# EAGLE design ATTINY85-V3.1 (EAGLE 6.1)
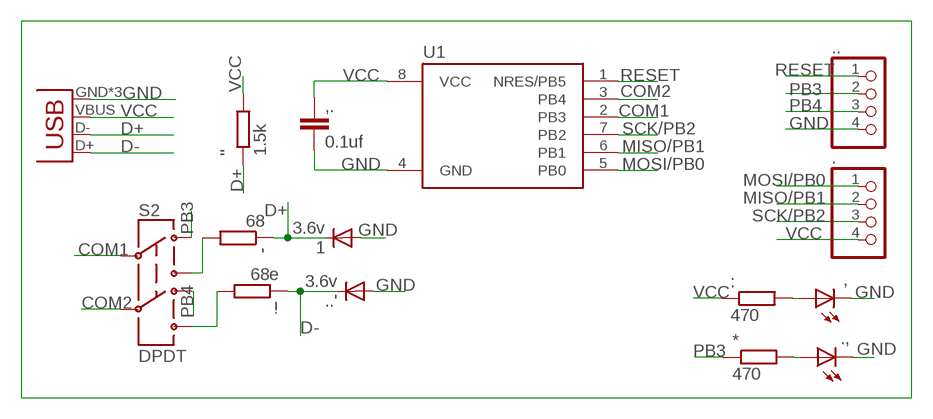
[diagram p0: schematic, sheet 1]

## Parts
1  3.6v  DIODE-MINIMELF  [MINIMELF]
!  68e  R-EU_M0805  [M0805]
'  68  R-EU_M0805  [M0805]
''  1.5k  R-EU_M0805  [M0805]
*  470  R-EU_M0805  [M0805]
+  USB-MICROB  [USB-MICROB]
,  LEDSML0805  [SML0805]
,.  0.1uf  C-EUC0805K  [C0805K]
.  HEADER-1X4ROUND  [1X04_ROUND]
.,  LEDSML0805  [SML0805]
..  HEADER-1X4ROUND  [1X04_ROUND]
..'  3.6v  DIODE-MINIMELF  [MINIMELF]
:  470  R-EU_M0805  [M0805]
S2  DPDT  SWITCH-DPDTAYZ0202  [AYZ0202]
U1  ATTINY85-20S  [SOIC8_EIAJ_208MIL]

## Nets
COM1: S2.2 U1.2(PB3)
COM2: S2.5 U1.3(PB4)
D+: 1.C ''.1 '.1 +.D-
D-: !.1 +.D+ ..'.C
GND: 1.A +.GND +.MT1(GND) +.MT2(GND) ,..2 ,.C .,.C ..'.A ...4 U1.4(GND)
MISO/PB1: ..2 U1.6(PB1)
MOSI/PB0: ..1 U1.5(PB0)
N$2: ,.A :.2
N$3: '.2 S2.3
N$4: !.2 S2.6
N$5: *.2 .,.A
PB3: *.1 ...2 S2.1
PB4: ...3 S2.4
RESET: ...1 U1.1(NRES/PB5)
SCK/PB2: ..3 U1.7(PB2)
VCC: ''.2 +.VBUS ,..1 ..4 :.1 U1.8(VCC)

## Library data of the parts
1 ..' = diode:DIODE-: DIODE
! ' '' * : = rcl:R-EU_: RESISTOR, European symbol
+ = SparkFun-Connectors:USB: USB Connectors USB-B-PTH is fully proven SKU : PRT-00139/CONN-08278 USB-miniB is fully proven SKU : PRT-00587 USB-A-PCB is untested. USB-A-H is throughly reviewed, but untested. Spark Fun Electronics SKU : PRT-00437 USB-B-SMT is throughly reviewed, but untested. Needs silkscreen touching up. USB-A-S has not been used/tested USB-MB-H has not been used/tested USB-MICROB has been used. CONN-09505; PROD_ID: CONN-09505
, ., = led:LED: LED OSRAM: - CHIPLED LG R971, LG N971, LY N971, LG Q971, LY Q971, LO R971, LY R971 LH N974, LH R974 LS Q976, LO Q976, LY Q976 LO Q996 - Hyper CHIPLED LW Q18S LB Q993, LB Q99A, LB R99A - SideLED LS A670, LO A670, LY A670, LG A670, LP A670 LB A673, LV A673, LT A673, LW A673 LH A674 LY A675 LS A676, LA A676, LO A676, LY A676, LW A676 LS A679, LY A679, LG A679 - Hyper Micro SIDELED® LS Y876, LA Y876, LO Y876, LY Y876 LT Y87S - SmartLED LW L88C, LW L88S LB L89C, LB L89S, LG L890 LS L89K, LO L89K, LY L89K LS L896, LA L896, LO L896, LY L896 - TOPLED LS T670, LO T670, LY T670, LG T670, LP T670 LSG T670, LSP T670, LSY T670, LOP T670, LYG T670 LG T671, LOG T671, LSG T671 LB T673, LV T673, LT T673, LW T673 LH T674 LS T676, LA T676, LO T676, LY T676, LB T676, LH T676, LSB T676, LW T676 LB T67C, LV T67C, LT T67C, LS T67K, LO T67K, LY T67K, LW E67C LS E67B, LA E67B, LO E67B, LY E67B, LB E67C, LV E67C, LT E67C LW T67C LS T679, LY T679, LG T679 LS T770, LO T770, LY T770, LG T770, LP T770 LB T773, LV T773, LT T773, LW T773 LH T774 LS E675, LA E675, LY E675, LS T675 LS T776, LA T776, LO T776, LY T776, LB T776 LHGB T686 LT T68C, LB T68C - Hyper Mini TOPLED® LB M676 - Mini TOPLED Santana® LG M470 LS M47K, LO M47K, LY M47K Source: http://www.osram.convergy.de LUXEON: - LUMILED® LXK2-PW12-R00, LXK2-PW12-S00, LXK2-PW14-U00, LXK2-PW14-V00 LXK2-PM12-R00, LXK2-PM12-S00, LXK2-PM14-U00 LXK2-PE12-Q00, LXK2-PE12-R00, LXK2-PE12-S00, LXK2-PE14-T00, LXK2-PE14-U00 LXK2-PB12-K00, LXK2-PB12-L00, LXK2-PB12-M00, LXK2-PB14-N00, LXK2-PB14-P00, LXK2-PB14-Q00 LXK2-PR12-L00, LXK2-PR12-M00, LXK2-PR14-Q00, LXK2-PR14-R00 LXK2-PD12-Q00, LXK2-PD12-R00, LXK2-PD12-S00 LXK2-PH12-R00, LXK2-PH12-S00 LXK2-PL12-P00, LXK2-PL12-Q00, LXK2-PL12-R00 Source: www.luxeon.com KINGBRIGHT: KA-3528ASYC Source: www.kingbright.com
,. = rcl:C-EU: CAPACITOR, European symbol
. .. = microbuilder:HEADER-1X4: PIN HEADER
S2 = SparkFun-Electromechanical:SWITCH-DPDT: DPDT Version of the COM-00597; PROD_ID: SWCH-08179
U1 = _hhn_attiny25_45_85:ATTINY85*: ATMEL ATtiny 85 Packages: P = PDIP 08 30mil S = SOIC 08 EIAJ 208mil Technologies Note: for complete ordering code (temp. range, finish, tape&reel etc.) see www.atmel.com • Supply Voltage: V = (1.8…5.5)V | [blank] = (2.7…5.5)V • Speed: 10 = 10 MHz | 20 = 20 MHz Author: Dipl.-Ing. FH Rainer Bayer HHN Hochschule Heilbronn (Heilbronn University), rainer.bayer@hs-heilbronn.de Ingenieurbüro ing-rb, mail@ing-rb.de

## Net classes
0 default: width 0.254 mm, clearance 0.152 mm
1 Power: width 0.254 mm, clearance 0.152 mm

## Board
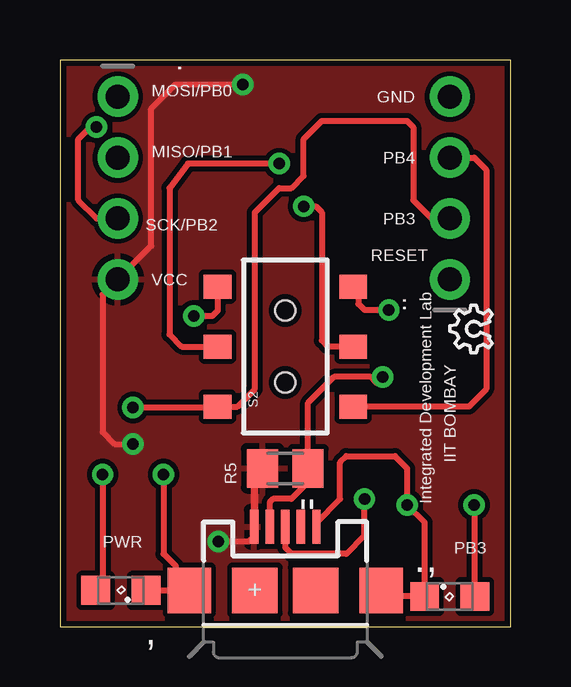
[diagram p1: board, top side]
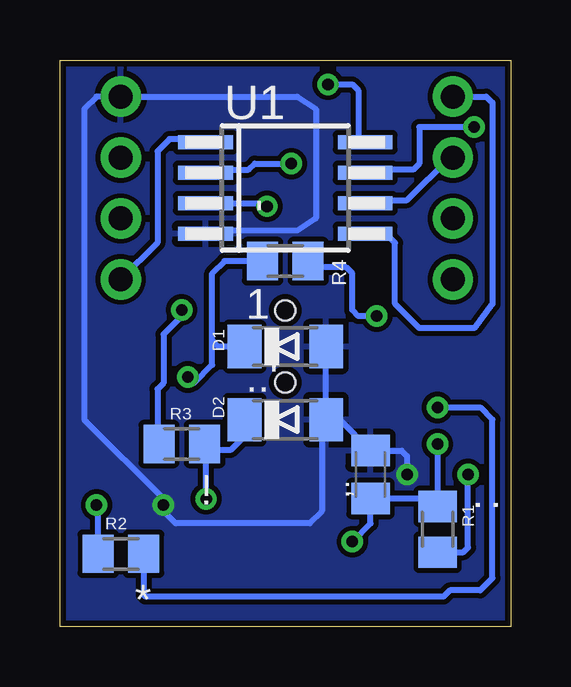
[diagram p2: board, bottom side, seen from below]

Size 18.8 x 23.62 mm. Coordinates in mm from the lower left corner, seen from the top.
Outline: 0,0 18.8,0 18.8,23.62 0,23.62 0,0
Copper layers (1*16): Top 0.035mm / dielectric 1.5mm / Bottom 0.035mm
Design rules: minimum track width 10mil, minimum drill 19mil, track to track 8mil, track to pad 8mil, pad to pad 8mil, via to via 8mil, smd to smd 8mil, copper to edge 10mil, drill to drill 8mil, minimum pad ring 10mil, minimum via ring 8mil, stop-mask expansion 4mil, vias tented up to drill 0mil, thermal gap 10mil

### Footprints (pad centres in the part's own frame; a part is rotated, then mirrored left to right if it is on the bottom)
MINIMELF = smd 1.4 x 1.8: A 1.7,0; C -1.7,0
M0805 = smd 1.3 x 1.6: 1 -0.95,0; 2 0.95,0
USB-MICROB = smd 0.35 x 1.4: D+ 0,2.65; D- -0.65,2.65; GND 1.3,2.65; ID 0.65,2.65; VBUS -1.3,2.65 | smd 1.8 x 1.9: MT1 -4,0; MT2 4,0 | smd 1.9 x 1.9: P$1 -1.27,0; P$2 1.27,0
SML0805 = smd 1.2 x 1.2: A 1.05,0; C -1.05,0
C0805K = smd 1.3 x 1.6: 1 -1,0; 2 1,0
1X04_ROUND = drill 1 pad 1.676: 1 -3.81,0; 2 -1.27,0; 3 1.27,0; 4 3.81,0
AYZ0202 = smd 1 x 1.15: 1 -2.5,2.825; 2 0,2.825; 3 2.5,2.825; 4 -2.5,-2.825; 5 0,-2.825; 6 2.5,-2.825 | hole 0.85: 1.5,0; -1.5,0
SOIC8_EIAJ_208MIL = smd 0.6 x 2.286: 1 -1.905,-3.33; 2 -0.635,-3.33; 3 0.635,-3.33; 4 1.905,-3.33; 5 1.905,3.33; 6 0.635,3.33; 7 -0.635,3.33; 8 -1.905,3.33

### Placement (x,y rotation side)
1  9.4,11.68 0 bottom
!  13.72,7.62 180 bottom
'  9.4,15.24 0 bottom
''  9.4,6.6 180 top
*  16.26,3.05 180 bottom
+  9.4,1.52 0 top
,  2.54,1.52 180 top
,.  5.84,6.35 90 bottom
.  2.41,18.29 270 top
.,  16.26,1.27 0 top
..  16.26,18.29 90 top
..'  9.4,8.64 0 bottom
:  3.05,4.06 270 bottom
S2  9.4,11.68 90 top
U1  9.4,18.29 270 bottom
U$1  [OSHW_6X70_NOTEXT]  18.03,11.43 90 top

### Tracks (layer width: path | path; a pad name or v marks a point on that pad's centre or on a via)
COM1  (via drill 0.48)
  Top 0.254: v9.14,19.3 5.33,19.3 4.57,18.29 4.57,12.19 5.08,11.68 S2.2 6.6,11.68
  Bottom 0.254: U1.2 12.6,19.05 10.92,19.05 10.67,19.3 v9.14,19.3
COM2  (via drill 0.48)
  Top 0.254: S2.5 11.18,11.68 10.92,11.94 10.92,17.27 10.67,17.53 v10.16,17.53
  Bottom 0.254: U1.3 10.29,17.65 v10.16,17.53
D+  (via drill 0.48)
  Top 0.254: v13.46,10.41 13.21,10.16 12.95,10.41 11.43,10.41 10.35,9.33 ''.1 10.16,6.42 10.16,5.84 9.65,5.33 8.89,5.33 8.75,5.19 +.D-
  Bottom 0.254: '.1 11.94,15.24 12.45,14.73 12.45,11.94 | 12.45,11.94 12.45,10.92 13.21,10.16 v13.46,10.41 | 1.C 12.19,11.68 12.45,11.94
D-  (via drill 0.48)
  Top 0.254: v12.7,5.33 12.7,3.81 11.94,3.05 9.65,3.05 9.4,3.3 +.D+
  Bottom 0.254: ..'.C 11.1,7.95 11.68,7.37 12.7,7.37 | 12.7,7.37 12.7,7.62 !.1 | v12.7,5.33 12.7,7.37
GND  (via drill 0.48)
  Top 0.254: ,.C 4.83,1.52 | 4.83,1.52 +.MT1 | +.MT2 13.65,1.27 .,.C 15.21,4.35 v14.48,5.08 14.48,6.6 13.97,7.11 11.94,7.11 11.68,6.86 11.68,5.33 10.67,4.32 10.67,4.2 +.GND | v4.32,6.35 4.32,3.05 4.83,2.54 4.83,1.52
  Bottom 0.254: v4.32,6.35 4.32,7.11 4.56,7.35 ,..2 7.13,8.64 7.62,8.64 | 1.A ..'.A 7.87,8.46 7.87,4.83 8.38,4.32 13.97,4.32 14.48,4.83 v14.48,5.08 14.48,5.33 17.78,8.64 17.78,21.59 17.27,22.1 ...4 8.89,22.1 8.13,21.59 8.13,17.02 8.89,16.51 11.94,16.51 12.06,16.38 U1.4
  pour Bottom: 0,23.62 18.8,23.62 18.8,0 0,0
MISO/PB1
  Bottom 0.254: U1.6 5.94,17.78 4.32,17.78 2.54,19.56 ..2
MOSI/PB0
  Bottom 0.254: ..1 1.02,22.1 0.76,21.84 0.76,13.46 1.52,12.45 3.81,12.45 4.83,13.46 4.83,16 5.21,16.38 U1.5 6.1,16.36 6.1,16.26 6.35,16.26
N$2  (via drill 0.48)
  Top 0.254: v1.78,6.35 1.78,1.81 ,.A
  Bottom 0.254: :.2 1.97,3.11 1.78,3.3 v1.78,6.35
N$3  (via drill 0.48)
  Top 0.254: S2.3 6.57,13.18 6.35,12.95 v5.59,12.95
  Bottom 0.254: v5.59,12.95 6.35,12.95 6.6,13.21 6.6,14.73 6.86,14.99 8.19,14.99 '.2 8.38,15.24 8.38,14.99
N$4  (via drill 0.48)
  Top 0.254: S2.6 12.23,14.44 12.49,14.44 12.45,14.22 12.45,13.46 12.7,13.21 v13.72,13.21
  Bottom 0.254: !.2 14.73,7.69 14.73,9.91 14.48,10.16 14.48,12.19 13.72,12.95 v13.72,13.21
N$5  (via drill 0.48)
  Top 0.254: v17.27,5.08 17.27,1.27 .,.A
  Bottom 0.254: *.2 17.21,5.01 v17.27,5.08
PB3  (via drill 0.48)
  Top 0.254: v3.05,9.14 6.53,9.14 S2.1 7.41,9.18 8.13,9.91 8.13,17.27 9.14,18.29 9.65,18.29 10.16,18.8 10.16,20.32 10.92,21.08 14.48,21.08 14.73,20.83 14.73,17.78 15.49,17.02 ...2
  Bottom 0.254: *.1 15.31,1.34 15.24,1.27 2.79,1.27 2.54,1.52 1.27,1.52 0.76,2.03 0.76,8.64 1.27,9.14 v3.05,9.14
PB4
  Top 0.254: ...3 17.27,19.56 17.78,19.05 17.78,9.91 17.06,9.18 S2.4
RESET
  Bottom 0.254: U1.1 12.86,20.32 14.22,20.32 14.73,19.81 14.73,16 ...1
SCK/PB2  (via drill 0.48)
  Top 0.254: ..3 1.52,17.02 0.76,17.78 0.76,20.32 1.27,20.83 v1.52,20.83
  Bottom 0.254: 6.99,18.92 U1.7 5.46,18.92 5.33,19.05 4.06,19.05 3.81,19.3 3.81,20.83 v1.52,20.83
VCC  (via drill 0.48)
  Top 0.254: 8.1,6.25 ''.2 | +.VBUS 8.1,6.25 | v7.62,22.61 4.83,22.61 3.81,21.59 3.81,15.88 ..4 1.78,13.84 1.78,8.13 2.29,7.62 v3.05,7.62 | 8.1,6.25 8.13,6.22 8.13,3.81 7.87,3.56 v6.6,3.56
  Bottom 0.254: v7.62,22.61 6.6,22.61 6.35,22.35 6.35,20.32 5.97,20.19 | 5.97,20.19 6.1,20.07 | 5.97,20.19 U1.8 | v3.05,7.62 :.1 2.98,5.33 5.84,5.33 ,..1 5.84,4.32 v6.6,3.56
  pour Top: 0,23.62 18.8,23.62 18.8,0 0,0

### Text on the board
tNames: MOSI/PB0 | GND | MISO/PB1 | PB4 | SCK/PB2 | PB3 | RESET | VCC | Integrated Development Lab | R5 | IIT BOMBAY | PB3 | PWR
bNames: R4 | D1 | D2 | R3 | R1 | R2